# EAGLE design Mainboard v0 (EAGLE 9.6.2)
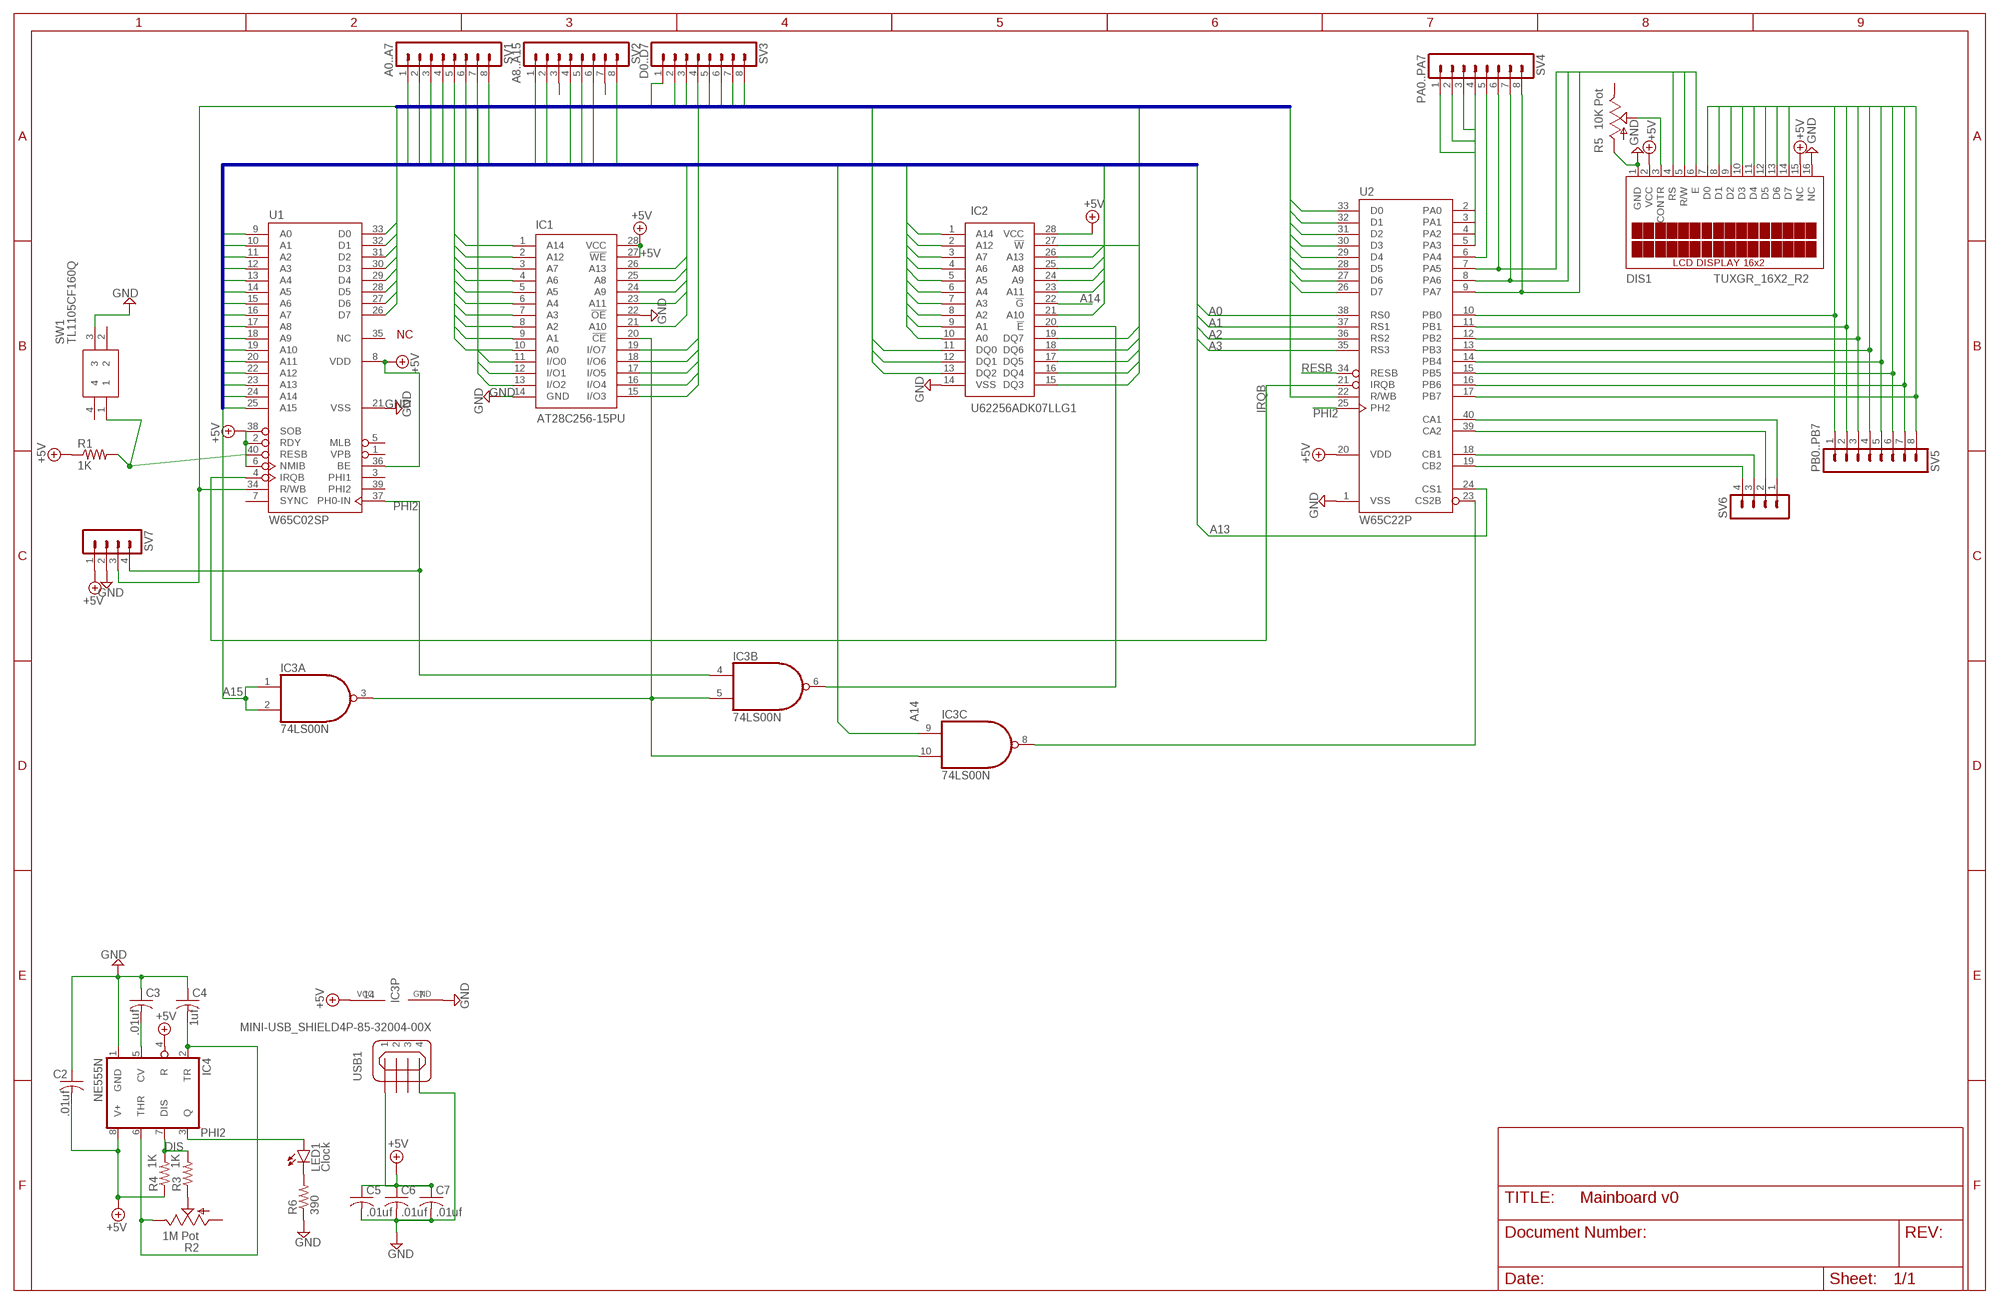
[diagram p0: schematic, sheet 1]

## Parts
C2  .01uf  C-US075-032X103  [C075-032X103]
C3  .01uf  C-US075-032X103  [C075-032X103]
C4  1uf  C-US075-032X103  [C075-032X103]
C5  .01uf  C-US075-032X103  [C075-032X103]
C6  .01uf  C-US075-032X103  [C075-032X103]
C7  .01uf  C-US075-032X103  [C075-032X103]
DIS1  TUXGR_16X2_R2  [TUXGR_16X2_R2]
IC1  AT28C256-15PU  [DIP1556W56P254L3702H483Q28N]
IC2  U62256ADK07LLG1  [DIP1524W59P254L3710H510Q28N]
IC3  74LS00N  [DIL14]
IC4  NE555N  [DIL08]
LED1  Clock  LED5MM  [LED5MM]
R1  1K  R-US_0204/7  [0204/7]
R2  1M Pot  TRIM_US-B25U  [B25U]
R3  1K  R-US_0204/7  [0204/7]
R4  1K  R-US_0204/7  [0204/7]
R5  10K Pot  TRIM_US-B25U  [B25U]
R6  390  R-US_0204/7  [0204/7]
SV1  A0..A7  MA08-1NL  [MA08-1]
SV2  A8..A15  MA08-1  [MA08-1]
SV3  D0..D7  MA08-1  [MA08-1]
SV4  PA0..PA7  MA08-1  [MA08-1]
SV5  PB0..PB7  MA08-1  [MA08-1]
SV6  MA04-1  [MA04-1]
SV7  MA04-1  [MA04-1]
SW1  TL1105CF160Q  [TL1105CF160Q]
U1  W65C02SP  [DIP-40]
U2  W65C22P  G65SC22P  [DIP-40]
USB1  MINI-USB_SHIELD4P-85-32004-00X  [85-32004-00X]

## Nets
+5V: C2.2 C5.1 C6.1 C7.1 DIS1.2(VCC) DIS1.15(NC) IC1.27(!WE) IC1.28(VCC) IC2.28(VCC) IC3.14(P:VCC) IC4.4(R) IC4.8(V+) R1.1 R4.1 SV7.1 U1.2(RDY) U1.6(NMIB) U1.8(VDD) U1.36(BE) U1.38(SOB) U2.20(VDD) USB1.1
A0: IC1.10(A0) IC2.10(A0) SV1.1 U1.9(A0) U2.38(RS0)
A1: IC1.9(A1) IC2.9(A1) SV1.2 U1.10(A1) U2.37(RS1)
A2: IC1.8(A2) IC2.8(A2) SV1.3 U1.11(A2) U2.36(RS2)
A3: IC1.7(A3) IC2.7(A3) SV1.4 U1.12(A3) U2.35(RS3)
A4: IC1.6(A4) IC2.6(A4) SV1.5 U1.13(A4)
A5: IC1.5(A5) IC2.5(A5) SV1.6 U1.14(A5)
A6: IC1.4(A6) IC2.4(A6) SV1.7 U1.15(A6)
A7: IC1.3(A7) IC2.3(A7) SV1.8 U1.16(A7)
A8: IC1.25(A8) IC2.25(A8) SV2.1 U1.17(A8)
A9: IC1.24(A9) IC2.24(A9) SV2.2 U1.18(A9)
A10: IC1.21(A10) IC2.21(A10) SV2.3 U1.19(A10)
A11: IC1.23(A11) IC2.23(A11) SV2.4 U1.20(A11)
A12: IC1.2(A12) IC2.2(A12) SV2.5 U1.22(A12)
A13: IC1.26(A13) IC2.26(A13) SV2.6 U1.23(A13) U2.24(CS1)
A14: IC1.1(A14) IC2.1(A14) IC2.22(!G) IC3.9(C:I0) SV2.7 U1.24(A14)
A15: IC3.1(A:I0) IC3.2(A:I1) SV2.8 U1.25(A15)
CLK-1: C4.2 IC4.2(TR) IC4.6(THR) R2.E
D0: IC1.11(I/O0) IC2.11(DQ0) SV3.1 U1.33(D0) U2.33(D0)
D1: IC1.12(I/O1) IC2.12(DQ1) SV3.2 U1.32(D1) U2.32(D1)
D2: IC1.13(I/O2) IC2.13(DQ2) SV3.3 U1.31(D2) U2.31(D2)
D3: IC1.15(I/O3) IC2.15(DQ3) SV3.4 U1.30(D3) U2.30(D3)
D4: IC1.16(I/O4) IC2.16(DQ4) U1.29(D4) U2.29(D4)
D5: IC1.17(I/O5) IC2.17(DQ5) SV3.5 SV3.6 U1.28(D5) U2.28(D5)
D6: IC1.18(I/O6) IC2.18(DQ6) SV3.7 U1.27(D6) U2.27(D6)
D7: IC1.19(I/O7) IC2.19(DQ7) SV3.8 U1.26(D7) U2.26(D7)
DIS: IC4.7(DIS) R3.2 R4.2
GND: C2.1 C3.1 C4.1 C5.2 C6.2 C7.2 DIS1.1(GND) DIS1.16(NC) IC1.14(GND) IC1.22(!OE) IC2.14(VSS) IC3.7(P:GND) IC4.1(GND) R5.A R6.1 SV7.2 SW1.3 U1.21(VSS) U2.1(VSS) USB1.4
IRQB: U1.4(IRQB) U2.21(IRQB)
N$1: IC1.20(!CE) IC3.3(A:O) IC3.5(B:I1) IC3.10(C:I1)
N$2: IC3.8(C:O) U2.23(CS2B)
N$3: R2.S R3.1
N$4: C3.2 IC4.5(CV)
N$5: LED1.K(C) R6.2
N$6: IC2.20(!E) IC3.6(B:O)
N$7: DIS1.3(CONTR) R5.S
N$8: DIS1.7(D0) SV5.1 U2.10(PB0)
N$9: DIS1.8(D1) SV5.2 U2.11(PB1)
N$10: DIS1.9(D2) SV5.3 U2.12(PB2)
N$11: DIS1.10(D3) SV5.4 U2.13(PB3)
N$12: DIS1.11(D4) SV5.5 U2.14(PB4)
N$13: DIS1.12(D5) SV5.6 U2.15(PB5)
N$14: DIS1.13(D6) SV5.7 U2.16(PB6)
N$15: DIS1.14(D7) SV5.8 U2.17(PB7)
N$16: DIS1.6(E) SV4.8 U2.9(PA7)
N$17: DIS1.5(R/W) SV4.7 U2.8(PA6)
N$18: DIS1.4(RS) SV4.6 U2.7(PA5)
N$19: SV4.1 U2.2(PA0)
N$20: SV4.2 U2.3(PA1)
N$21: SV4.3 U2.4(PA2)
N$22: SV4.4 U2.5(PA3)
N$23: SV4.5 U2.6(PA4)
N$24: SV6.1 U2.40(CA1)
N$25: SV6.2 U2.39(CA2)
N$26: SV6.3 U2.18(CB1)
N$27: SV6.4 U2.19(CB2)
PHI2: IC3.4(B:I0) IC4.3(Q) LED1.A SV7.4 U1.37(PH0-IN) U2.25(PH2)
RESB: R1.2 SW1.1 U1.40(RESB) U2.34(RESB)
RWB: IC2.27(!W) SV7.3 U1.34(R/WB) U2.22(R/WB)
Unconnected: IC3.11(D:O) IC3.12(D:I0) IC3.13(D:I1) R2.A R5.E SW1.2 SW1.4 U1.1(VPB) U1.3(PHI1) U1.5(MLB) U1.7(SYNC) U1.35(NC) U1.39(PHI2) USB1.2 USB1.3 USB1.M1(S1) USB1.M2(S2)

## Buses
ADDR:A0,A1,A2,A3,A4,A5,A6,A7,A8,A9,A10,A11,A12,A13,A14,A15
DATA:D0,D1,D2,D3,D4,D5,D6,D7,RWB

## Library data of the parts
C2-C7 = rcl:C-US: CAPACITOR, American symbol; SPICEPREFIX: C
DIS1 = display-lcd:TUXGR_16X2_R2: Tuxgraphics LCD display 16x2 characters reflective, without background light Source: tuxgr_12x2_r2.pdf; OC_FARNELL: unknown; OC_NEWARK: unknown
IC1 = SamacSys_Parts:AT28C256-15PU: AT28C256-15PU, Parallel EEPROM Memory 256kbit, Parallel, 150ns 4.5 5.5 V, 28-Pin PDIP Source: Datasheet <http://docs-emea.rs-online.com/webdocs/1383/0900766b81383aa7.pdf>; ARROW_PART_NUMBER: AT28C256-15PU; ARROW_PRICE-STOCK: https://www.arrow.com/en/products/at28c256-15pu/microchip-technology; DESCRIPTION: AT28C256-15PU, Parallel EEPROM Memory 256kbit, Parallel, 150ns 4.5 5.5 V, 28-Pin PDIP; HEIGHT: 4.826mm; MANUFACTURER_NAME: Microchip; MANUFACTURER_PART_NUMBER: AT28C256-15PU; MOUSER_PART_NUMBER: 556-AT28C25615PU; MOUSER_PRICE-STOCK: https://www.mouser.co.uk/ProductDetail/Microchip-Technology-Atmel/AT28C256-15PU?qs=MAR%2F2X5XOp7eAU2%2FlNw9oA%3D%3D
IC2 = SamacSys_Parts:U62256ADK07LLG1: SRAM ZMD 32K x 8 5V Asynch Source: Datasheet <https://www.alliancememory.com/wp-content/uploads/pdf/ZMD_U62256A.pdf>; DESCRIPTION: SRAM ZMD 32K x 8 5V Asynch; HEIGHT: 5.1mm; MANUFACTURER_NAME: Alliance Memory; MANUFACTURER_PART_NUMBER: U62256ADK07LLG1; MOUSER_PART_NUMBER: 913-U62256ADK07LLG1; MOUSER_PRICE-STOCK: https://www.mouser.co.uk/ProductDetail/Alliance-Memory/U62256ADK07LLG1?qs=LD2UibpCYJr50j%252B%252B4ajYoA%3D%3D
IC3 = 74xx-us:74*00: Quad 2-input NAND gate
IC4 = linear:*555: TIMER
LED1 = led:LED: LED OSRAM: - CHIPLED LG R971, LG N971, LY N971, LG Q971, LY Q971, LO R971, LY R971 LH N974, LH R974 LS Q976, LO Q976, LY Q976 LO Q996 - Hyper CHIPLED LW Q18S LB Q993, LB Q99A, LB R99A - SideLED LS A670, LO A670, LY A670, LG A670, LP A670 LB A673, LV A673, LT A673, LW A673 LH A674 LY A675 LS A676, LA A676, LO A676, LY A676, LW A676 LS A679, LY A679, LG A679 - Hyper Micro SIDELED® LS Y876, LA Y876, LO Y876, LY Y876 LT Y87S - SmartLED LW L88C, LW L88S LB L89C, LB L89S, LG L890 LS L89K, LO L89K, LY L89K LS L896, LA L896, LO L896, LY L896 - TOPLED LS T670, LO T670, LY T670, LG T670, LP T670 LSG T670, LSP T670, LSY T670, LOP T670, LYG T670 LG T671, LOG T671, LSG T671 LB T673, LV T673, LT T673, LW T673 LH T674 LS T676, LA T676, LO T676, LY T676, LB T676, LH T676, LSB T676, LW T676 LB T67C, LV T67C, LT T67C, LS T67K, LO T67K, LY T67K, LW E67C LS E67B, LA E67B, LO E67B, LY E67B, LB E67C, LV E67C, LT E67C LW T67C LS T679, LY T679, LG T679 LS T770, LO T770, LY T770, LG T770, LP T770 LB T773, LV T773, LT T773, LW T773 LH T774 LS E675, LA E675, LY E675, LS T675 LS T776, LA T776, LO T776, LY T776, LB T776 LHGB T686 LT T68C, LB T68C - Hyper Mini TOPLED® LB M676 - Mini TOPLED Santana® LG M470 LS M47K, LO M47K, LY M47K Source: http://www.osram.convergy.de LUXEON: - LUMILED® LXK2-PW12-R00, LXK2-PW12-S00, LXK2-PW14-U00, LXK2-PW14-V00 LXK2-PM12-R00, LXK2-PM12-S00, LXK2-PM14-U00 LXK2-PE12-Q00, LXK2-PE12-R00, LXK2-PE12-S00, LXK2-PE14-T00, LXK2-PE14-U00 LXK2-PB12-K00, LXK2-PB12-L00, LXK2-PB12-M00, LXK2-PB14-N00, LXK2-PB14-P00, LXK2-PB14-Q00 LXK2-PR12-L00, LXK2-PR12-M00, LXK2-PR14-Q00, LXK2-PR14-R00 LXK2-PD12-Q00, LXK2-PD12-R00, LXK2-PD12-S00 LXK2-PH12-R00, LXK2-PH12-S00 LXK2-PL12-P00, LXK2-PL12-Q00, LXK2-PL12-R00 Source: www.luxeon.com KINGBRIGHT: KA-3528ASYC Source: www.kingbright.com
R1 R3 R4 R6 = rcl:R-US_: RESISTOR, American symbol; SPICEPREFIX: R
R2 R5 = pot:TRIM_US-: POTENTIOMETER
SV1 = con-lstb:MA08-1: PIN HEADER; SPICEPREFIX: X
SV2-SV5 = con-lstb:MA08-1: PIN HEADER; OC_FARNELL: unknown; OC_NEWARK: unknown
SV6 SV7 = con-lstb:MA04-1: PIN HEADER; OC_FARNELL: unknown; OC_NEWARK: unknown
SW1 = SamacSys_Parts:TL1105CF160Q: Tactile Switches 6X6X8MM 160GF Source: Datasheet <https://componentsearchengine.com/Datasheets/1/TL1105CF160Q.pdf>; DESCRIPTION: Tactile Switches 6X6X8MM 160GF; HEIGHT: 8mm; MANUFACTURER_NAME: E-Switch; MANUFACTURER_PART_NUMBER: TL1105CF160Q; MOUSER_PART_NUMBER: 612-TL1105C; MOUSER_PRICE-STOCK: https://www.mouser.co.uk/ProductDetail/E-Switch/TL1105CF160Q?qs=YXf4ACKMM4yAAz%252BbnhourA%3D%3D
U1 = 65xxx:W65C02SP: Western Digital Version
U2 = 65xxx:G65SC22P: California Micro Devices Version
USB1 = con-cypressindustries:MINI-USB_SHIELD4P-: MINI USB 4 Pol. Source: www.cypressindustries.com; OC_FARNELL: unknown; OC_NEWARK: unknown

## Net classes
0 default: clearance 0.205 mm

## Board
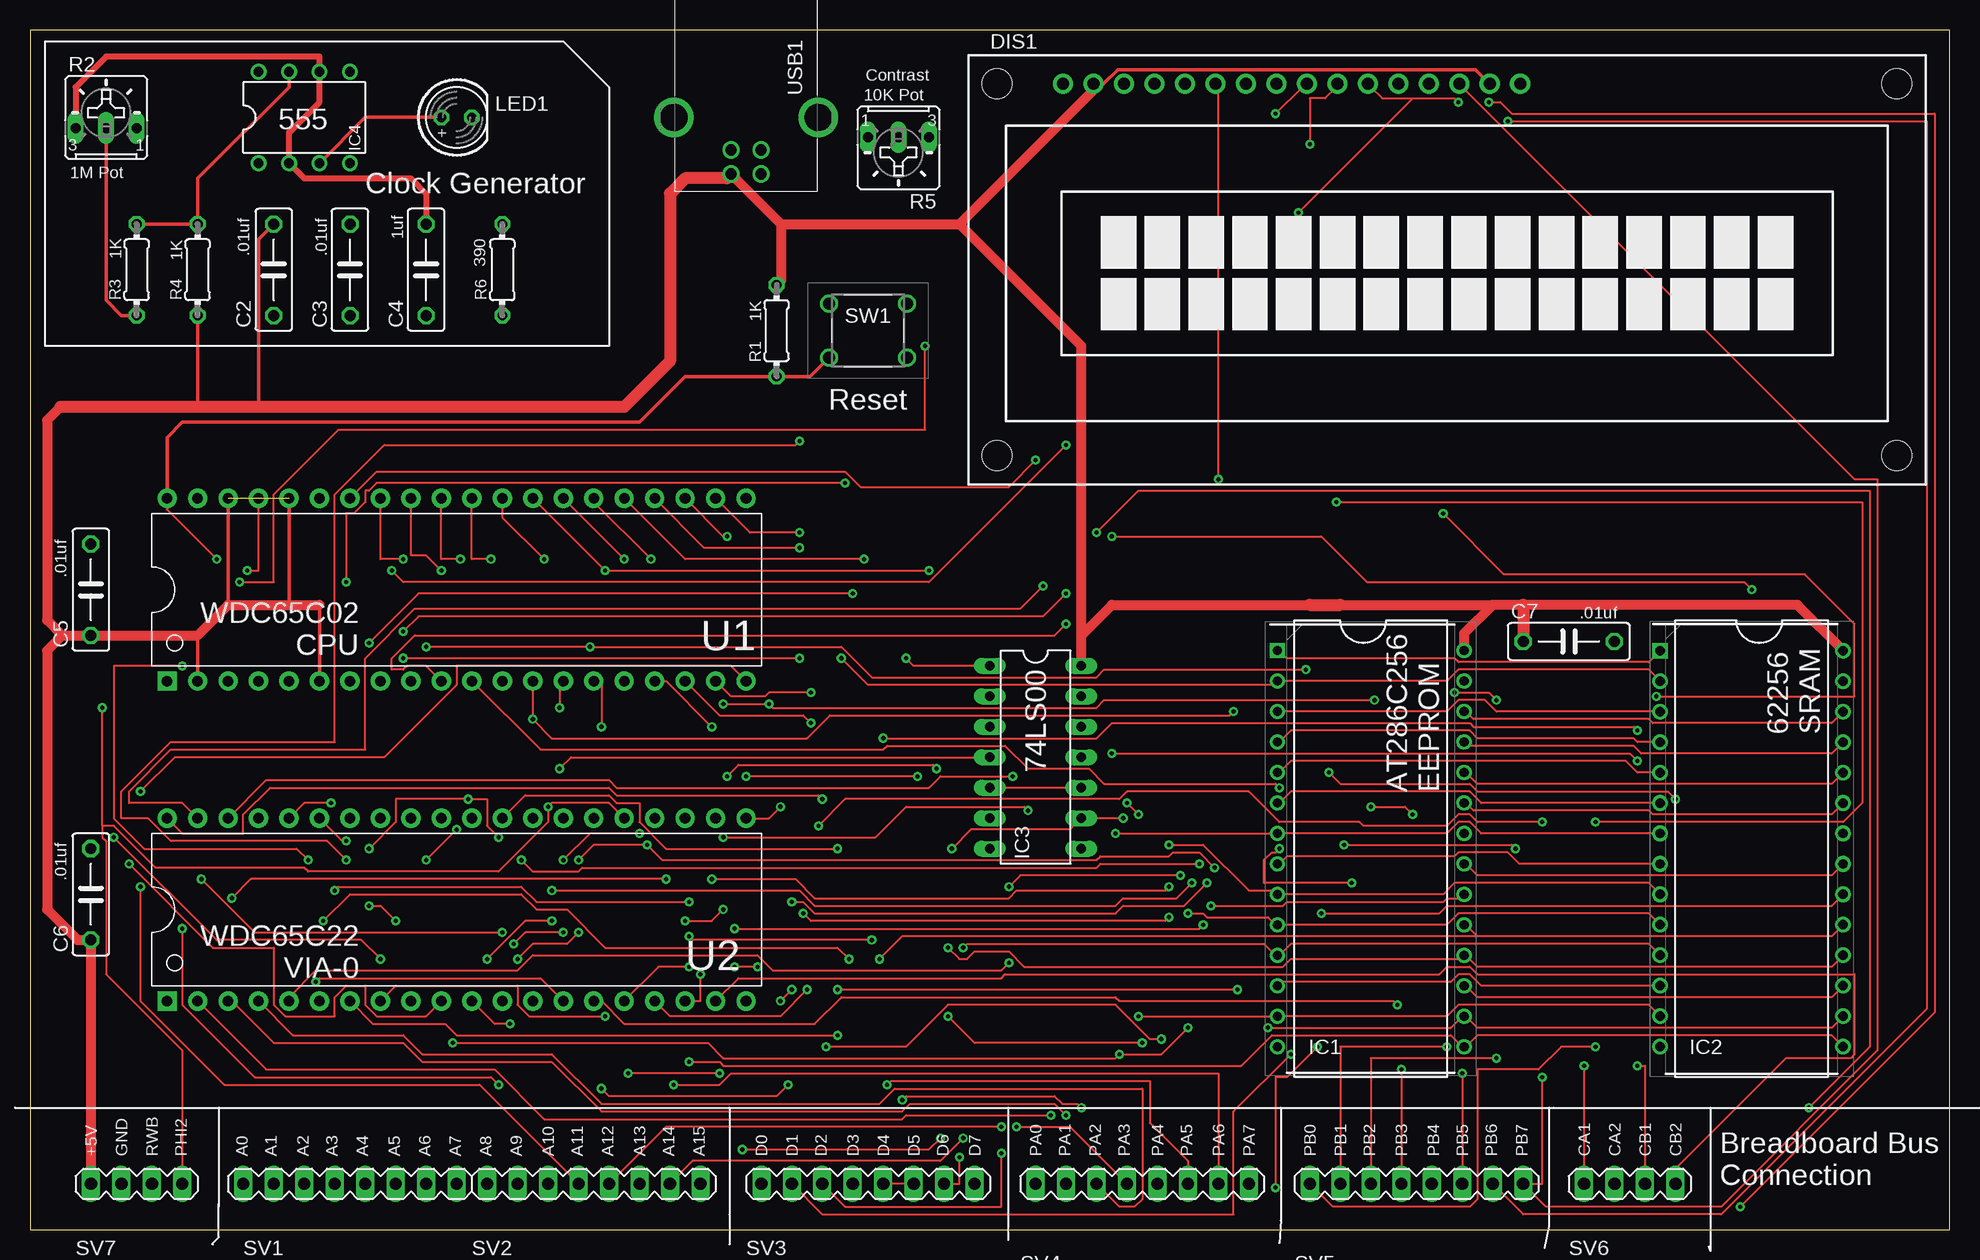
[diagram p1: board, top side]
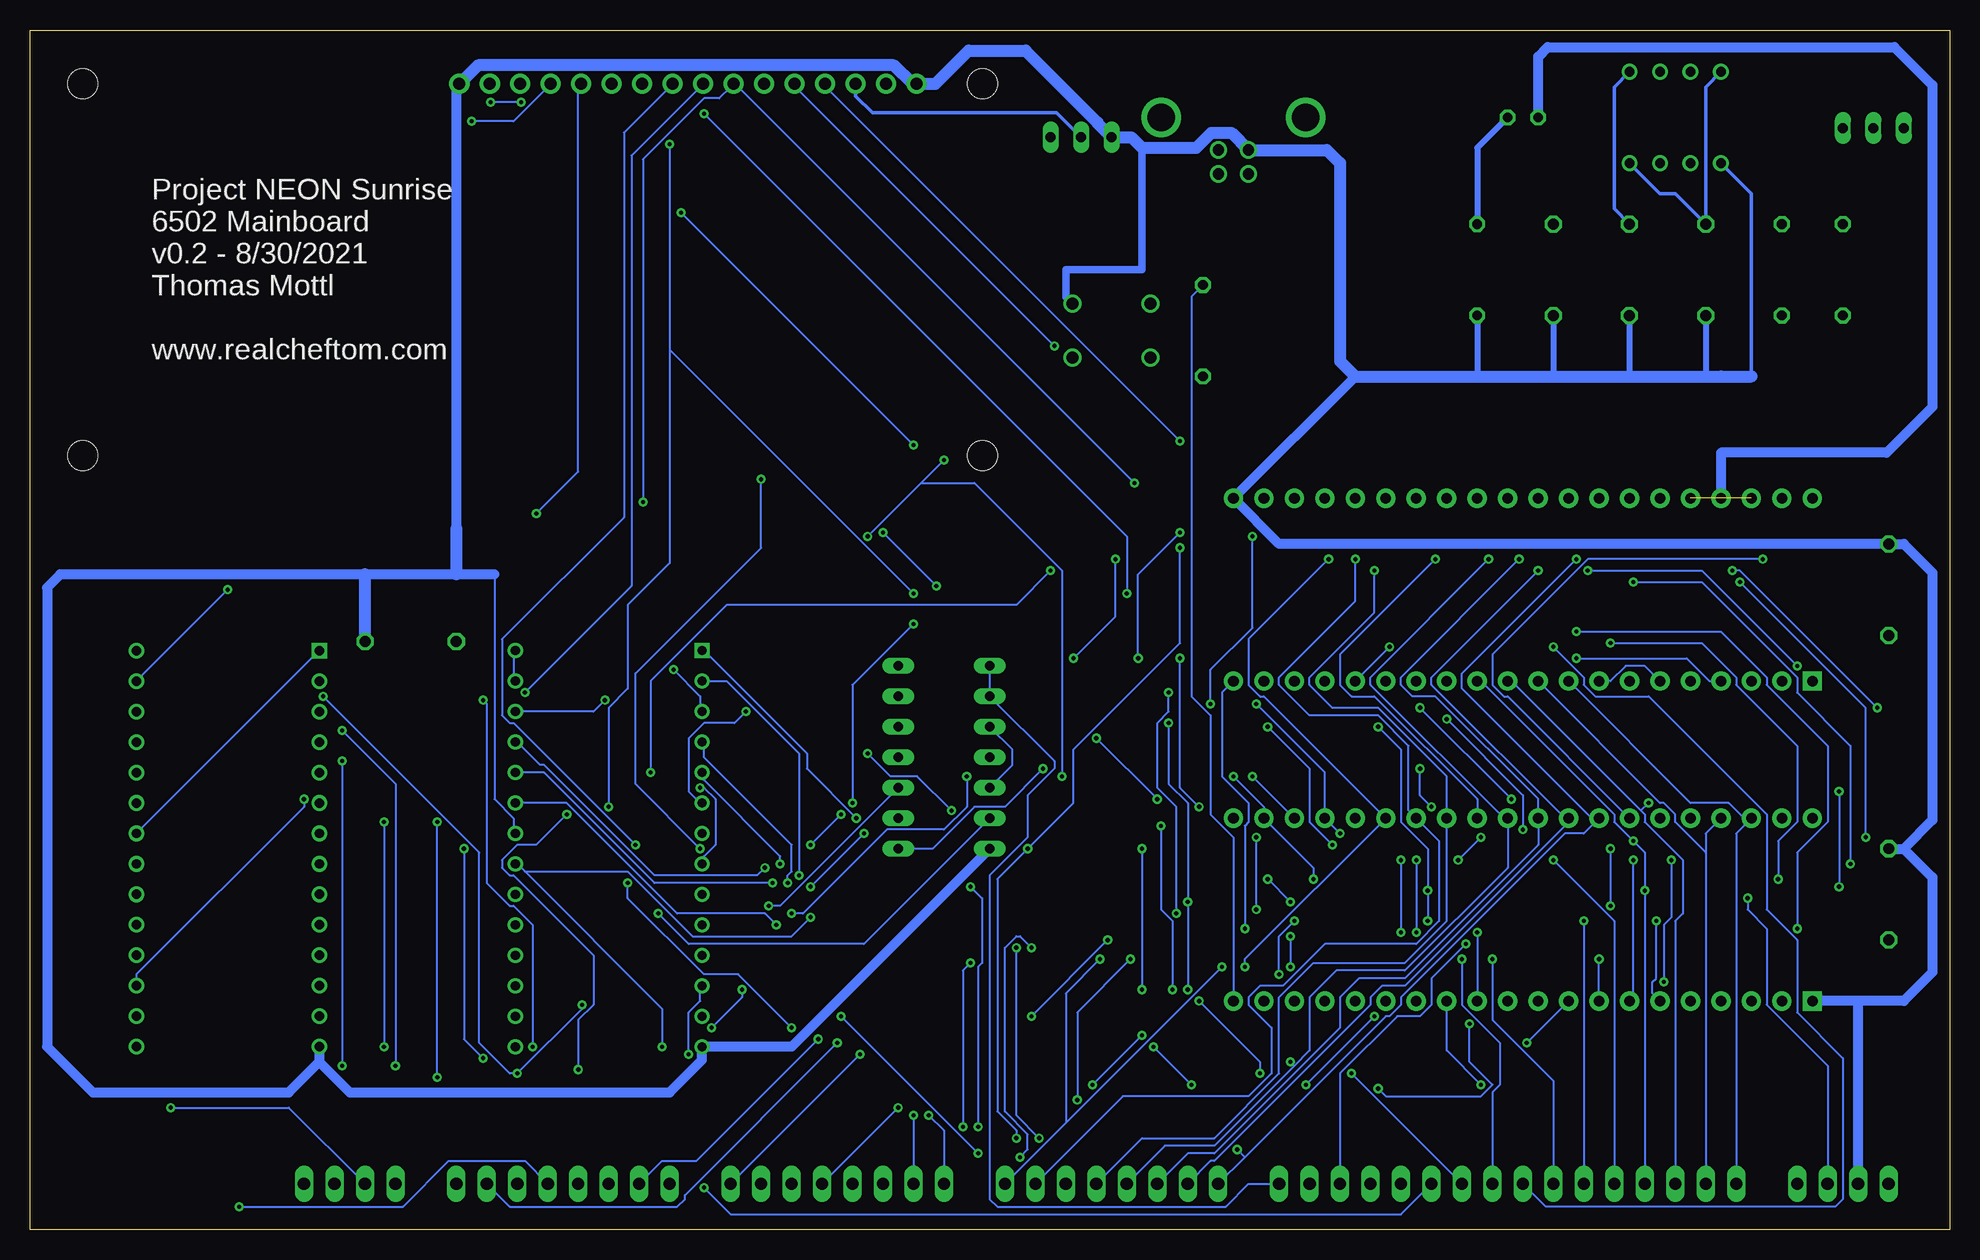
[diagram p2: board, bottom side, seen from below]

Size 160 x 100 mm. Coordinates in mm from the lower left corner, seen from the top.
Outline: 0,0 154.94,0 160,0 160,100 0,100 0,0
Copper layers (1*16): Top 0.035mm / dielectric 1.5mm / Bottom 0.035mm
Design rules "default": minimum track width 6mil, minimum drill 0.35mm, track to track 6mil, track to pad 6mil, pad to pad 6mil, via to via 6mil, smd to smd 6mil, copper to edge 40mil, drill to drill 6mil, minimum pad ring 10mil, minimum via ring 8mil, stop-mask expansion 4mil, vias tented up to drill 0mil, thermal gap 10mil

### Footprints (pad centres in the part's own frame; a part is rotated, then mirrored left to right if it is on the bottom)
C075-032X103 = drill 0.914 octagon: 1 -3.81,0; 2 3.81,0
TUXGR_16X2_R2 = drill 1 pad 1.676: 1 -32,15.5; 2 -29.46,15.5; 3 -26.92,15.5; 4 -24.38,15.5; 5 -21.84,15.5; 6 -19.3,15.5; 7 -16.76,15.5; 8 -14.22,15.5; 9 -11.68,15.5; 10 -9.14,15.5; 11 -6.6,15.5; 12 -4.06,15.5; 13 -1.52,15.5; 14 1.02,15.5; 15 3.56,15.5; 16 6.1,15.5 | hole 2.5: -37.5,-15.5; 37.5,-15.5; -37.5,15.5; 37.5,15.5
DIP1556W56P254L3702H483Q28N = drill 0.759 pad 1.159 square: 1 -7.779,16.51 | drill 0.759 pad 1.159: 2 -7.779,13.97; 3 -7.779,11.43; 4 -7.779,8.89; 5 -7.779,6.35; 6 -7.779,3.81; 7 -7.779,1.27; 8 -7.779,-1.27; 9 -7.779,-3.81; 10 -7.779,-6.35; 11 -7.779,-8.89; 12 -7.779,-11.43; 13 -7.779,-13.97; 14 -7.779,-16.51; 15 7.779,-16.51; 16 7.779,-13.97; 17 7.779,-11.43; 18 7.779,-8.89; 19 7.779,-6.35; 20 7.779,-3.81; 21 7.779,-1.27; 22 7.779,1.27; 23 7.779,3.81; 24 7.779,6.35; 25 7.779,8.89; 26 7.779,11.43; 27 7.779,13.97; 28 7.779,16.51
DIP1524W59P254L3710H510Q28N = drill 0.79 pad 1.19 square: 1 -7.62,16.51 | drill 0.79 pad 1.19: 2 -7.62,13.97; 3 -7.62,11.43; 4 -7.62,8.89; 5 -7.62,6.35; 6 -7.62,3.81; 7 -7.62,1.27; 8 -7.62,-1.27; 9 -7.62,-3.81; 10 -7.62,-6.35; 11 -7.62,-8.89; 12 -7.62,-11.43; 13 -7.62,-13.97; 14 -7.62,-16.51; 15 7.62,-16.51; 16 7.62,-13.97; 17 7.62,-11.43; 18 7.62,-8.89; 19 7.62,-6.35; 20 7.62,-3.81; 21 7.62,-1.27; 22 7.62,1.27; 23 7.62,3.81; 24 7.62,6.35; 25 7.62,8.89; 26 7.62,11.43; 27 7.62,13.97; 28 7.62,16.51
DIL14 = drill 0.813 long: 1 -7.62,-3.81; 2 -5.08,-3.81; 3 -2.54,-3.81; 4 0,-3.81; 5 2.54,-3.81; 6 5.08,-3.81; 7 7.62,-3.81; 8 7.62,3.81; 9 5.08,3.81; 10 2.54,3.81; 11 0,3.81; 12 -2.54,3.81; 13 -5.08,3.81; 14 -7.62,3.81
DIL08 = drill 0.813 pad 1.27: 1 -3.81,-3.81; 2 -1.27,-3.81; 3 1.27,-3.81; 4 3.81,-3.81; 5 3.81,3.81; 6 1.27,3.81; 7 -1.27,3.81; 8 -3.81,3.81
LED5MM = drill 0.813 octagon: A -1.27,0; K 1.27,0
0204/7 = drill 0.813 octagon: 1 -3.81,0; 2 3.81,0
B25U = drill 0.813 long: A 2.54,-0.889; E -2.54,-0.889; S 0,-0.889
MA08-1 = drill 1.016 long: 1 -8.89,0; 2 -6.35,0; 3 -3.81,0; 4 -1.27,0; 5 1.27,0; 6 3.81,0; 7 6.35,0; 8 8.89,0
MA04-1 = drill 1.016 long: 1 -3.81,0; 2 -1.27,0; 3 1.27,0; 4 3.81,0
TL1105CF160Q = drill 1 pad 1.5: 1 -3.25,-2.25; 2 3.25,-2.25; 3 3.25,2.25; 4 -3.25,2.25
DIP-40 = drill 0.889 pad 1.6 square: 1 -22.86,-7.62 | drill 0.889 pad 1.6: 2 -20.32,-7.62; 3 -17.78,-7.62; 4 -15.24,-7.62; 5 -12.7,-7.62; 6 -10.16,-7.62; 7 -7.62,-7.62; 8 -5.08,-7.62; 9 -2.54,-7.62; 10 0,-7.62; 11 2.54,-7.62; 12 5.08,-7.62; 13 7.62,-7.62; 14 10.16,-7.62; 15 12.7,-7.62; 16 15.24,-7.62; 17 17.78,-7.62; 18 20.32,-7.62; 19 22.86,-7.62; 20 25.4,-7.62; 21 25.4,7.62; 22 22.86,7.62; 23 20.32,7.62; 24 17.78,7.62; 25 15.24,7.62; 26 12.7,7.62; 27 10.16,7.62; 28 7.62,7.62; 29 5.08,7.62; 30 2.54,7.62; 31 0,7.62; 32 -2.54,7.62; 33 -5.08,7.62; 34 -7.62,7.62; 35 -10.16,7.62; 36 -12.7,7.62; 37 -15.24,7.62; 38 -17.78,7.62; 39 -20.32,7.62; 40 -22.86,7.62
85-32004-00X = drill 0.92 pad 1.27: 1 4.71,-1.25; 2 4.71,1.25; 3 2.71,1.25; 4 2.71,-1.25 | drill 2.3 pad 3: M1 0,6.02; M2 0,-6.02

### Placement (x,y rotation side)
C2  20.32,80.01 90 top
C3  26.67,80.01 90 top
C4  33.02,80.01 90 top
C5  5.08,53.34 90 top
C6  5.08,27.94 90 top
C7  128.27,49.02 0 top
DIS1  118.11,80.01 0 top
IC1  111.76,31.75 0 top
IC2  143.51,31.75 0 top
IC3  83.82,39.37 270 top
IC4  22.86,92.71 0 top
LED1  35.56,92.71 0 top
R1  62.23,74.93 270 top
R2  6.35,92.71 0 top
R3  8.89,80.01 90 top
R4  13.97,80.01 90 top
R5  72.39,90.17 180 top
R6  39.37,80.01 90 top
SV1  26.67,3.81 0 top
SV2  46.99,3.81 0 top
SV3  69.85,3.81 0 top
SV4  92.71,3.81 0 top
SV5  115.57,3.81 0 top
SV6  133.35,3.81 0 top
SV7  8.89,3.81 0 top
SW1  69.85,74.93 0 top
U1  34.29,53.34 0 top
U2  34.29,26.67 0 top
USB1  59.69,92.71 270 top

### Tracks (layer width: path | path; a pad name or v marks a point on that pad's centre or on a via)
+5V  (1 unrouted)
  Top 0.305: C2.2 19.05,82.55 19.05,68.58 | R4.1 13.97,68.58 | U1.2 13.97,49.53 | 16.51,52.07 U1.38 | 24.13,52.07 U1.6 | U1.36 21.59,52.07 | DIS1.2 89.5,95.51 90.69,96.71 120.47,96.71 DIS1.15
  Top 0.813: 2.54,68.58 1.42,67.46 1.42,50.8 2.69,49.53 | 2.69,49.53 C5.1 13.97,49.53 16.51,52.07 24.13,52.07 | 2.69,49.53 1.42,48.26 1.42,26.67 3.96,24.13 C6.1 SV7.1 | USB1.1 62.62,83.82 | 62.62,83.82 77.47,83.82 | 77.47,83.82 88.65,95 DIS1.2 | IC2.28 147.32,52.07 124.46,52.07 121.92,52.07 | 121.92,52.07 119.54,49.69 IC1.28 | 109.22,52.07 121.92,52.07 | IC3.14 87.63,49.53 | 106.68,52.07 90.17,52.07 87.63,49.53 | 87.63,49.53 87.63,73.66 77.47,83.82 | 62.62,83.82 62.62,79.13 R1.1
  Top 1.016: USB1.1 58.07,87.63 54.61,87.63 53.34,86.36 53.34,72.39 49.53,68.58 19.05,68.58 13.97,68.58 2.54,68.58 | 106.68,52.07 109.22,52.07 | 124.46,52.07 C7.1
  Bottom 0.152: IC1.27 119.7,45.72 119.7,48.26 IC1.28 | U2.20 59.69,32.7 61.59,34.61 61.59,42.86 63.18,44.45 63.18,77.79 R1.1 | U1.8 28.26,45.72 26.99,46.99 25.4,46.99 U1.6
  Bottom 0.305: IC4.4 24.13,86.36 22.86,86.36 C2.2 20.32,95.25 IC4.8
A0  (via drill 0.35)
  Top 0.152: IC2.10 134.94,26.35 119.06,26.35 118.11,25.4 104.14,25.4 IC1.10 103.82,25.4 103.19,26.04 98.11,26.04 97.79,26.35 v96.52,26.35 | v81.92,37.78 75.88,37.78 74.93,36.83 48.9,36.83 48.26,37.47 19.68,37.47 U2.38
  Bottom 0.152: SV1.1 17.78,33.02 16.83,33.97 | 16.83,33.97 U2.38 16.83,33.97 | U1.9 21.59,35.56 18.41,35.56 16.83,33.97 | v96.52,26.35 95.57,26.35 88.58,33.34 83.82,33.34 81.92,35.24 v81.92,37.78
A1  (via drill 0.35)
  Top 0.152: IC2.9 134.94,28.89 118.75,28.89 117.79,27.94 104.14,27.94 IC1.9 103.82,27.94 103.5,28.26 101.6,28.26 97.79,32.07 v94.93,32.07 | v91.44,35.56 v92.39,34.61 | v86.36,50.48 85.41,49.53 32.07,49.53 30.16,47.62 30.16,46.67 31.11,46.67 31.43,46.99 33.02,46.99 U1.10
  Bottom 0.152: 20.32,31.43 20.32,33.02 U2.37 | 20.32,31.43 SV1.2 | U1.10 24.13,35.56 23.81,35.56 22.86,34.61 22.86,33.97 20.32,31.43 | v92.39,34.61 v94.93,32.07 | v91.44,35.56 91.44,45.4 v86.36,50.48
A2  (via drill 0.35)
  Top 0.152: IC2.8 124.14,30.48 123.19,31.43 119.06,31.43 118.75,31.11 104.78,31.11 104.14,30.48 IC1.8 | U2.36 22.86,35.56 v25.08,35.56 | v104.14,36.83 103.82,37.15 89.53,37.15 88.27,38.42 83.19,38.42 81.28,40.32 71.44,40.32 71.12,40.01 42.55,40.01 U1.11
  Bottom 0.152: SV1.3 22.86,25.72 22.23,26.35 22.23,30.8 25.4,33.97 25.4,34.61 25.72,34.92 | 25.72,34.92 36.51,45.72 U1.11 | 25.72,34.92 v25.08,35.56 | v104.14,36.83 103.82,36.83 102.87,35.88 102.87,32.07 103.82,31.11 103.82,30.48 IC1.8
A3  (via drill 0.35)
  Top 0.152: IC2.7 120.97,33.02 120.02,33.97 119.06,33.97 118.11,33.02 104.14,33.02 IC1.7 103.82,33.02 v90.49,33.02 | U2.35 26.04,32.38 v26.35,32.38 | v94.93,28.57 94.61,28.26 82.23,28.26 81.6,27.62 65.41,27.62 63.82,29.21 v56.83,29.21 | v54.93,27.3 42.23,27.3 40.96,28.57 25.72,28.57 v25.4,28.26
  Bottom 0.152: SV1.4 v25.4,28.26 25.4,31.43 v26.35,32.38 27.94,33.97 27.94,34.61 39.05,45.72 U1.12 | v94.93,28.57 v90.49,33.02 | v54.93,27.3 v56.83,29.21
A4  (via drill 0.35)
  Top 0.152: IC2.6 120.97,35.56 120.02,36.51 105.09,36.51 104.14,35.56 IC1.6 | v35.56,33.34 v33.02,30.8 | U1.13 v41.91,42.55 43.5,40.96 64.77,40.96 66.67,42.86 100.01,42.86 v100.33,43.18
  Bottom 0.152: SV1.5 27.94,25.72 v33.02,30.8 | v35.56,33.34 35.56,36.2 v41.91,42.55 | v100.33,43.18 101.28,42.23 103.82,42.23 105.09,40.96 105.09,36.51 104.14,35.56 IC1.6
A5  (via drill 0.35)
  Top 0.152: IC2.5 133.99,38.1 133.03,39.05 105.09,39.05 104.14,38.1 IC1.5 | v30.48,25.72 29.21,26.99 v28.26,26.99 | v28.26,31.75 30.48,33.97 30.48,35.88 v36.51,35.88 38.1,35.88 38.1,33.66 v39.05,32.7 | v44.13,43.5 44.13,45.72 U1.14 | v97.47,30.48 89.22,30.48 88.9,30.16 46.04,30.16 45.72,29.84 41.91,29.84 v40.96,30.8
  Bottom 0.152: v30.48,25.72 SV1.6 | v28.26,31.75 v28.26,26.99 | v44.13,43.5 v36.51,35.88 | v97.47,30.48 97.47,31.11 103.82,37.47 103.82,38.1 IC1.5 | v39.05,32.7 v40.96,30.8
A6  (via drill 0.35)
  Top 0.152: IC2.4 133.99,40.64 133.67,40.96 120.65,40.96 120.02,41.59 105.09,41.59 104.14,40.64 IC1.4 | v38.1,22.54 41.27,25.72 v43.5,25.72 | v47.62,41.91 47.62,45.72 U1.15 | v96.84,28.89 95.57,27.62 91.12,27.62 90.49,26.99 65.41,26.99 64.14,28.26 v43.5,28.26
  Bottom 0.152: SV1.7 33.02,12.38 38.1,17.46 v38.1,22.54 | v43.5,25.72 v43.5,28.26 43.5,31.75 45.72,33.97 45.72,40.01 v47.62,41.91 | v96.84,28.89 96.84,29.53 96.52,29.84 96.52,32.07 103.82,39.37 103.82,40.64 IC1.4
A7  (via drill 0.35)
  Top 0.152: IC2.3 122.24,43.18 121.28,44.13 119.06,44.13 118.11,43.18 104.14,43.18 IC1.3 | v33.02,48.58 v46.67,48.58 67.63,48.58 70.17,46.04 88.9,46.04 89.53,46.67 v106.36,46.67
  Bottom 0.152: SV1.8 33.66,1.91 9.53,1.91 8.89,2.54 8.89,14.29 12.7,18.1 12.7,24.13 15.24,26.67 15.24,34.61 25.08,44.45 29.53,44.45 30.48,45.4 30.48,46.04 v33.02,48.58 | U1.16 v46.67,48.58 | v106.36,46.67 104.14,44.45 104.14,43.18 IC1.3
A8  (via drill 0.35)
  Top 0.152: IC2.25 150.18,39.69 134.3,39.69 133.67,40.32 120.02,40.32 119.7,40.64 IC1.25 | v40.64,22.54 41.91,23.81 44.77,23.81 v45.72,24.77 | v45.72,30.8 46.99,32.07 v51.44,32.07 52.7,30.8 88.9,30.8 89.22,31.11 94.93,31.11 95.25,31.43 97.47,31.43 v98.74,30.16 | v56.83,41.91 53.02,45.72 U1.17
  Bottom 0.152: SV2.1 38.1,11.43 37.47,12.06 37.47,15.56 40.64,18.73 v40.64,22.54 | v45.72,30.8 v45.72,24.77 | v51.44,32.07 53.34,33.97 53.34,38.42 v56.83,41.91 | v98.74,30.16 99.38,29.53 107.95,29.53 117.16,38.73 117.47,38.73 119.38,40.64 IC1.25
A9  (via drill 0.35)
  Top 0.152: IC2.24 150.18,37.15 120.65,37.15 119.7,38.1 IC1.24 | v57.47,13.02 v49.85,13.02 | v63.5,20 v62.55,19.05 | v65.09,42.23 64.45,42.86 57.47,42.86 U1.18 | v98.11,28.89 96.2,26.99 91.12,26.99 90.49,26.35 65.41,26.35 64.45,27.3 v63.5,27.3
  Bottom 0.152: v49.85,13.02 SV2.2 | v57.47,13.02 57.47,13.97 v62.55,19.05 | v63.5,20 v63.5,27.3 63.5,35.56 65.09,37.15 v65.09,42.23 | v98.11,28.89 107.95,28.89 117.16,38.1 119.38,38.1 IC1.24
A10  (via drill 0.35)
  Top 0.152: IC2.21 150.18,29.53 120.65,29.53 119.7,30.48 IC1.21 | v103.82,3.49 103.82,12.7 104.78,12.7 v107.31,15.24 | U1.19 58.42,44.45 61.28,44.45 61.59,44.77 v65.09,44.77 | v64.45,26.35 65.09,25.72 94.61,25.72 v94.93,26.04
  Bottom 0.152: SV2.3 45.72,1.27 101.6,1.27 v103.82,3.49 | v107.31,15.24 107.31,18.41 118.75,29.84 | 118.75,29.84 119.38,30.48 IC1.21 | v65.09,44.77 65.09,43.18 66.04,42.23 66.04,36.83 64.45,35.24 v64.45,26.35 | v94.93,26.04 96.52,24.45 104.78,24.45 110.17,29.84 118.75,29.84
A11  (via drill 0.35)
  Top 0.152: IC2.23 150.18,34.61 135.25,34.61 134.94,34.92 120.33,34.92 119.7,35.56 IC1.23 | SV2.4 37.47,12.06 16.19,12.06 9.21,19.05 v9.21,28.57 | v9.21,36.51 12.06,39.37 29.53,39.37 35.56,45.4 35.56,46.99 58.42,46.99 U1.20 | v97.79,25.4 97.47,25.08 v58.74,25.08
  Bottom 0.152: v9.21,36.51 v9.21,28.57 | v97.79,25.4 98.74,26.35 106.05,26.35 115.25,35.56 119.38,35.56 IC1.23 | v58.74,25.08 58.74,33.66 58.42,33.97 58.42,35.56 60.64,37.78 60.64,44.77 U1.20
A12  (via drill 0.35)
  Top 0.152: IC2.2 134.94,46.67 119.06,46.67 118.11,45.72 104.14,45.72 IC1.2 103.82,45.72 103.5,45.4 69.85,45.4 v67.63,47.62 | SV2.5 53.02,8.57 v80.96,8.57 | v81.6,28.57 82.55,29.53 v95.89,29.53 | U1.22 60.01,58.1 v64.14,58.1
  Bottom 0.152: v80.96,8.57 80.96,21.91 80.64,22.23 80.64,27.62 v81.6,28.57 | v95.89,29.53 95.89,39.69 101.92,45.72 103.82,45.72 IC1.2 | v64.14,58.1 67.63,54.61 v67.63,47.62
A13  (via drill 0.35)
  Top 0.152: IC2.26 150.18,42.23 135.25,42.23 134.94,42.55 120.33,42.55 119.7,43.18 IC1.26 | v40.32,23.81 41.27,24.77 v44.45,24.77 | v44.45,30.8 46.67,33.02 v50.8,33.02 | U1.23 57.78,57.78 v58.1,57.78 | v57.78,43.81 v61.59,43.81 61.91,43.5 88.9,43.5 89.53,44.13 v112.08,44.13
  Bottom 0.152: SV2.6 50.8,13.02 46.04,17.78 44.13,17.78 43.18,18.73 43.18,20.95 v40.32,23.81 | v44.45,30.8 v44.45,24.77 | v50.8,33.02 U2.24 52.07,38.1 v57.78,43.81 | v58.1,57.78 58.1,50.16 61.59,46.67 v61.59,43.81 | v112.08,44.13 113.03,43.18 119.38,43.18 IC1.26
A14  (via drill 0.35)
  Top 0.152: IC2.1 134.94,47.31 119.06,47.31 118.75,47.62 104.78,47.62 104.14,48.26 IC1.1 | v91.12,34.29 IC3.9 86.68,33.34 78.42,33.34 v76.83,31.75 | SV2.7 55.24,5.71 75.88,5.71 v77.79,7.62 | U1.24 56.2,56.83 v64.14,56.83
  Bottom 0.152: IC2.1 IC2.22 | v91.12,34.29 95.25,38.42 95.25,39.69 103.82,48.26 IC1.1 | v77.79,7.62 77.79,8.26 79.38,9.84 79.38,29.21 v76.83,31.75 73.03,35.56 73.03,40.01 64.14,48.9 v64.14,56.83
A15  (via drill 0.35)
  Top 0.152: U1.25 54.61,55.88 v69.53,55.88 | v73.03,47.62 73.66,46.99 IC3.1
  Bottom 0.152: IC3.1 IC3.2 74.61,39.05 74.61,38.42 76.83,36.2 76.83,32.7 80.01,29.53 80.01,2.54 79.38,1.91 60.33,1.91 58.42,3.81 SV2.8 | v69.53,55.88 69.53,51.12 v73.03,47.62
CLK-1
  Top 0.508: R2.E 3.81,95.25 6.35,97.79 24.13,97.79 IC4.6 24.13,93.98 21.59,91.44 IC4.2 22.86,87.63 31.75,87.63 33.02,86.36 C4.2
D0  (via drill 0.35)
  Top 0.152: IC2.11 134.94,23.81 105.09,23.81 104.14,22.86 IC1.11 103.82,22.86 102.87,23.81 78.11,23.81 v77.79,23.5 | U1.33 29.21,55.88 v31.11,55.88 | v75.88,7.62 74.93,6.67 v59.37,6.67
  Bottom 0.152: 58.74,6.03 46.99,17.78 46.67,17.78 45.72,18.73 45.72,19.37 32.07,33.02 30.48,33.02 29.53,33.97 | 58.74,6.03 SV3.1 | 29.53,33.97 U2.33 29.53,33.97 | v31.11,55.88 40.64,46.35 40.64,45.09 29.53,33.97 | v77.79,23.5 77.79,9.53 v75.88,7.62 | 58.74,6.03 v59.37,6.67
D1  (via drill 0.35)
  Top 0.152: IC2.12 120.97,20.32 120.02,21.27 119.06,21.27 118.43,20.64 104.46,20.64 104.14,20.32 IC1.12 | U1.32 31.75,56.2 33.02,56.2 v34.29,54.93 | v105.09,14.61 100.33,9.84 100.33,1.27 66.04,1.27 SV3.2
  Bottom 0.152: SV3.2 61.59,5.71 61.28,5.71 48.26,18.73 48.26,19.37 47.31,20.32 45.4,20.32 31.75,33.97 | 31.75,33.97 U2.32 31.75,33.97 | v34.29,54.93 43.18,46.04 43.18,45.4 31.75,33.97 | v105.09,14.61 105.09,18.1 104.14,19.05 104.14,20.32 IC1.12
D2  (via drill 0.35)
  Top 0.152: IC2.13 134.94,18.73 119.06,18.73 118.11,17.78 104.14,17.78 IC1.13 103.82,17.78 v92.39,17.78 | U1.31 34.29,55.88 v35.88,55.88 | v80.96,6.35 80.96,1.91 67.94,1.91 SV3.3
  Bottom 0.152: SV3.3 63.5,6.35 61.28,6.35 50.8,16.83 50.8,19.37 49.21,20.95 45.4,20.95 34.29,32.07 U2.31 34.29,35.88 42.86,44.45 44.77,44.45 45.72,45.4 45.72,46.04 v35.88,55.88 | v80.96,6.35 v92.39,17.78
D3  (via drill 0.35)
  Top 0.152: IC2.15 150.18,16.19 120.65,16.19 119.7,15.24 IC1.15 119.38,15.24 118.43,16.19 103.5,16.19 100.97,13.65 57.78,13.65 57.47,13.97 v54.93,13.97 | U1.30 36.83,55.88 v38.42,55.88
  Bottom 0.152: SV3.4 65.41,6.99 61.28,6.99 54.61,13.65 | 54.61,13.65 53.34,14.92 53.34,19.37 51.12,21.59 45.4,21.59 36.83,30.16 36.83,33.97 | 36.83,33.97 U2.30 36.83,33.97 | v38.42,55.88 48.26,46.04 48.26,45.4 36.83,33.97 | 54.61,13.65 v54.93,13.97
D4  (via drill 0.35)
  Top 0.152: IC2.16 150.18,16.83 120.65,16.83 119.7,17.78 IC1.16 119.38,17.78 118.43,16.83 v103.19,16.83 | v42.86,55.88 39.37,59.37 U1.29 | v67.31,20 v100.65,20 | v67.31,31.75 53.02,31.75 50.8,33.97 50.8,35.56 48.9,35.56 48.26,36.2 41.27,36.2 U2.29
  Bottom 0.152: U2.29 39.37,35.88 47.94,44.45 49.85,44.45 50.8,45.4 50.8,47.94 v42.86,55.88 | v103.19,16.83 100.65,19.37 v100.65,20 | v67.31,31.75 v67.31,20
D5  (via drill 0.35)
  Top 0.152: IC2.17 150.18,19.37 120.65,19.37 119.7,20.32 IC1.17 | SV3.6 SV3.5 | U1.28 v47.94,54.93 v74.93,54.93 | v137.16,35.88 136.53,36.51 120.65,36.51 120.02,37.15 109.22,37.15 v108.27,38.1
  Bottom 0.152: SV3.5 67.31,7.62 61.28,7.62 55.88,13.02 55.88,19.37 53.02,22.23 45.4,22.23 41.91,25.72 U2.28 41.91,37.78 47.62,43.5 51.44,43.5 53.34,45.4 53.34,46.04 47.94,51.44 v47.94,54.93 | IC2.17 151.13,21.27 137.16,35.24 v137.16,35.88 | v108.27,38.1 108.27,45.72 101.92,52.07 77.79,52.07 v74.93,54.93
D6  (via drill 0.35)
  Top 0.152: IC2.18 150.18,21.91 120.65,21.91 119.7,22.86 IC1.18 119.38,22.86 119.06,22.54 105.09,22.54 104.46,21.91 82.87,21.91 81.6,23.18 78.74,23.18 78.11,22.54 77.47,22.54 v76.52,23.5 | v49.53,55.88 U1.27 | v77.47,6.03 77.47,3.81 SV3.7
  Bottom 0.152: SV3.7 68.9,11.11 58.42,11.11 56.52,13.02 56.52,16.83 58.42,18.73 58.42,19.37 57.47,20.32 55.56,20.32 52.07,23.81 44.45,23.81 42.55,25.72 42.55,32.38 U2.27 45.09,34.92 45.09,40.32 47.62,42.86 53.34,42.86 55.88,45.4 55.88,46.04 49.53,52.39 v49.53,55.88 | v76.52,23.5 77.47,24.45 77.79,24.45 78.74,23.5 78.74,9.84 76.83,7.94 76.83,6.67 v77.47,6.03
D7  (via drill 0.35)
  Top 0.152: v51.75,55.88 46.99,60.64 U1.26 | 120.65,24.45 119.7,25.4 IC1.19 | 120.65,24.45 150.18,24.45 IC2.19 | v70.8,22.54 72.71,24.45 120.65,24.45 | v60.64,21.91 v58.74,21.91
  Bottom 0.152: v51.75,55.88 58.42,49.21 58.42,45.4 57.47,44.45 57.15,44.45 U2.26 58.74,22.54 v58.74,21.91 | 73.66,8.89 SV3.8 | 73.66,8.89 73.66,19.68 v70.8,22.54 | 73.66,8.89 v60.64,21.91
DIS
  Top 0.305: R3.2 R4.2 13.97,87.63 21.59,95.25 IC4.7
GND
  Bottom 0.152: IC1.22 119.7,33.02 119.7,34.29 121.28,35.88 121.28,54.29 121.28,54.61
  Bottom 0.305: IC4.1 16.51,86.36 16.51,71.12 | 124.46,95.25 124.46,95.26 DIS1.16
  Bottom 0.508: R6.1 39.37,71.12 | C4.1 33.02,71.12 | C3.1 26.67,71.12 | C2.1 20.32,71.12
  Bottom 0.61: 67.31,90.17 67.31,80.01 73.66,80.01 73.66,77.74 SW1.3
  Bottom 0.813: 49.53,71.12 U1.21 55.88,57.15 C5.2 3.81,57.15 1.42,54.76 1.42,34.14 3.81,31.75 | C6.2 3.81,31.75 | 3.81,31.75 1.42,29.36 1.42,21.44 3.81,19.05 7.62,19.05 | 7.62,19.05 U2.1 | SV7.2 7.62,19.05 | IC2.14 135.89,13.97 | 135.89,13.97 133.35,11.43 106.68,11.43 103.98,14.13 IC1.14 96.52,15.24 IC3.7 | 124.46,95.25 124.46,58.42 | 121.28,54.61 124.46,54.61 132.08,54.61 135.89,54.61 157.48,54.61 158.58,53.51 158.58,15.24 154.77,11.43 138.43,11.43 135.89,13.97
  Bottom 1.016: 16.51,71.12 19.05,71.12 20.32,71.12 26.67,71.12 33.02,71.12 39.37,71.12 49.53,71.12 50.8,72.39 50.8,88.9 51.9,90 USB1.4 59.87,91.43 61.53,91.43 62.79,90.17 67.31,90.17 68.2,91.06 R5.A 71.02,92.23 71.02,92.29 77.01,98.28 81.76,98.28 84.53,95.51 DIS1.1 86.46,95.51 88.01,97.06 122.65,97.06 124.46,95.25 | 124.46,58.42 124.46,54.61 | C7.2 132.08,54.61
IRQB  (via drill 0.35)
  Top 0.152: v64.14,47.62 v31.11,47.62 | v62.55,35.24 61.59,34.29 U2.21
  Bottom 0.152: U1.4 20,45.72 21.91,47.62 v31.11,47.62 | v64.14,47.62 64.14,36.83 v62.55,35.24
N$1  (via drill 0.35)
  Top 0.152: v98.42,26.99 104.46,26.99 104.78,27.3 117.79,27.3 118.11,27.62 119.06,27.62 119.38,27.94 IC1.20 | IC3.10 IC3.5
  Bottom 0.152: v98.42,26.99 97.47,26.99 IC3.10 | IC3.3 78.11,40.01 78.11,38.73 IC3.5
N$2  (via drill 0.35)
  Top 0.152: v75.56,38.42 75.25,38.73 59.05,38.73 v58.1,37.78
  Bottom 0.152: IC3.8 84.77,31.75 81.28,35.24 78.74,35.24 v75.56,38.42 | U2.23 v58.1,37.78
N$3
  Top 0.305: R2.S 6.35,77.47 7.62,76.2 R3.1
N$4
  Bottom 0.305: IC4.5 27.94,95.25 27.94,85.09 C3.2
N$5
  Bottom 0.508: LED1.K 39.37,90.17 R6.2
N$6  (via drill 0.35)
  Top 0.152: IC2.20 150.18,26.99 118.11,26.99 117.47,26.35 v107.63,26.35
  Bottom 0.152: v107.63,26.35 105.09,23.81 90.49,23.81 IC3.6
N$7
  Bottom 0.305: DIS1.3 91.19,94.49 | 91.19,94.49 | 91.19,94.49 89.79,93.09 74.42,93.09 R5.S
N$8  (via drill 0.35)
  Top 0.152: SV5.1 108.58,1.91 120.02,1.91 120.65,2.54 120.65,13.34 125.73,13.34 127.64,15.24 v130.49,15.24 | v130.49,33.97 151.13,33.97 152.72,35.56 152.72,60.64 v108.9,60.64 | U2.10 33.02,17.78 28.89,17.78 27.94,18.73 27.94,20.32 26.35,20.32 25.4,19.37 25.4,17.78 21.27,17.78 20.32,18.73 20.32,23.5 15.24,23.5 v8.26,30.48 | v26.35,53.98 26.35,59.69 26.99,59.69 27.94,60.64 27.94,61.59 28.26,61.59 28.89,62.23 v67.94,62.23
  Bottom 0.152: v130.49,33.97 v130.49,15.24 | v108.9,60.64 108.9,89.22 103.82,94.3 102.55,94.3 101.6,95.25 DIS1.7 101.28,95.57 v67.94,62.23 | v8.26,30.48 8.26,40.32 12.7,44.77 12.7,46.04 20.64,53.98 v26.35,53.98
N$9  (via drill 0.35)
  Top 0.152: SV5.2 109.22,15.24 v118.11,15.24 | v122.24,44.13 121.6,44.77 v118.75,44.77 | U2.11 38.73,17.14 v40.01,17.14 | v47.62,11.75 48.26,11.11 62.23,11.11 v63.18,12.06 | v66.36,15.24 73.03,15.24 76.52,18.73 90.49,18.73 93.34,15.88 v94.3,15.88
  Bottom 0.152: v118.11,15.24 118.11,25.4 119.7,26.99 120.02,26.99 121.92,28.89 121.92,43.81 v122.24,44.13 | v118.75,44.77 109.86,53.66 109.86,89.53 104.14,95.25 DIS1.8 | v40.01,17.14 40.01,13.97 38.1,12.06 39.05,11.11 46.99,11.11 v47.62,11.75 | v66.36,15.24 v63.18,12.06 | v94.3,15.88 104.46,5.71 107.31,5.71 SV5.2
N$10  (via drill 0.35)
  Top 0.152: SV5.3 111.76,14.29 v122.24,14.29 | v123.83,31.75 123.51,32.07 v109.54,32.07 | v39.37,24.77 18.73,24.77 v14.29,29.21 | v28.26,48.9 32.38,53.02 v68.58,53.02 | v103.82,93.03 106.05,95.25 106.36,95.25 DIS1.9
  Bottom 0.152: v122.24,14.29 123.83,15.88 v123.83,31.75 | v109.54,32.07 119.7,42.23 120.02,42.23 120.65,42.86 120.65,49.21 110.49,59.37 110.49,91.44 106.68,95.25 DIS1.9 | v39.37,24.77 U2.12 | v14.29,29.21 14.29,32.38 12.7,33.97 12.7,40.32 17.78,45.4 17.78,46.04 20.64,48.9 v28.26,48.9 | v68.58,53.02 68.58,57.78 v103.82,93.03
N$11  (via drill 0.35)
  Top 0.152: v114.3,13.34 SV5.4 | v115.25,34.61 114.62,35.24 v111.76,35.24 | v106.68,90.49 106.68,94.3 107.95,94.3 108.9,95.25 DIS1.10 | v39.05,12.06 38.42,12.7 18.73,12.7 12.7,18.73 v12.7,25.08 | v31.11,49.85 32.38,51.12 84.45,51.12 v86.36,53.02
  Bottom 0.152: v114.3,13.34 114.3,17.46 113.03,18.73 113.03,22.86 119.7,29.53 120.02,29.53 120.65,30.16 120.65,30.8 119.38,32.07 117.79,32.07 v115.25,34.61 | v111.76,35.24 111.76,43.5 110.17,45.09 110.17,52.07 106.68,55.56 106.68,73.34 | v106.68,90.49 106.68,73.34 | U2.13 41.91,14.92 v39.05,12.06 | v12.7,25.08 12.7,31.43 10.16,33.97 10.16,40.32 15.24,45.4 15.24,46.04 19.05,49.85 v31.11,49.85 | 106.68,73.34 v86.36,53.02
N$12  (via drill 0.35)
  Top 0.152: v142.56,1.91 158.75,18.1 158.75,93.03 123.51,93.03 122.56,93.98 v121.6,93.98 | v119.06,93.98 118.75,94.3 115.25,94.3 | 115.25,94.3 112.71,94.3 111.76,95.25 DIS1.11 | U2.14 42.55,20.95 24.13,20.95 v23.81,20.64 | v23.18,30.8 22.23,31.75 9.53,31.75 6.99,34.29 6.99,46.99 v12.7,46.99 | v30.16,54.93 31.11,53.98 74.93,53.98 v86.36,65.41 | 115.25,94.3 v105.73,84.77
  Bottom 0.152: SV5.5 118.75,5.71 125.09,5.71 128.91,1.91 v142.56,1.91 | v119.06,93.98 v121.6,93.98 | v23.81,20.64 23.81,25.4 23.18,26.04 v23.18,30.8 | v12.7,46.99 20.64,54.93 v30.16,54.93 | v105.73,84.77 v86.36,65.41
N$13  (via drill 0.35)
  Top 0.152: v119.38,13.02 SV5.6 | v113.98,18.73 113.67,19.05 90.81,19.05 90.49,19.37 67.63,19.37 65.41,17.14 49.53,17.14 47.62,19.05 U2.15 | v117.79,59.69 122.87,54.61 147.96,54.61 152.08,50.48 152.08,44.45 v135.57,44.45
  Bottom 0.152: v113.98,18.73 113.98,18.41 v119.38,13.02 120.02,13.02 122.56,15.56 122.56,31.43 v135.57,44.45 | v117.79,59.69 114.3,63.18 114.3,95.25 DIS1.12
N$14  (via drill 0.35)
  Top 0.152: SV5.7 124.46,1.27 140.97,1.27 158.12,18.41 158.12,92.39 v123.19,92.39 | U2.16 52.39,21.91 v54.93,21.91 | v54.93,24.45 55.24,24.13 v70.17,24.13 | v76.52,17.78 78.74,15.56 v92.71,15.56
  Bottom 0.152: v123.19,92.39 119.7,92.39 116.84,95.25 DIS1.13 | v54.93,24.45 v54.93,21.91 | v76.52,17.78 v70.17,24.13 | v92.71,15.56 105.41,2.86 105.41,2.54 106.05,1.91 120.02,1.91 SV5.7
N$15  (via drill 0.35)
  Top 0.152: DIS1.14 119.38,95.25 152.08,62.55 153.99,62.55 153.99,14.92 140.97,1.91 126.36,1.91 SV5.8 126.05,3.81 v126.05,12.7 | U2.17 53.34,17.78 62.55,17.78 v64.77,20 | v65.72,33.66 67.94,35.88 90.81,35.88 91.44,36.51 101.6,36.51 104.14,33.97 110.81,33.97 111.12,33.66 118.11,33.66 119.06,34.61 120.02,34.61 120.65,33.97 v126.05,33.97
  Bottom 0.152: v64.77,20 64.77,25.72 65.72,26.67 v65.72,33.66 | v126.05,12.7 v126.05,33.97
N$16  (via drill 0.35)
  Top 0.152: v35.24,15.56 56.52,15.56 57.78,14.29 90.49,14.29 v90.81,14.61 94.3,14.61 v96.52,16.83 | v99.06,62.55 99.06,95.25 DIS1.6 | v104.14,31.75 103.82,31.43 103.5,31.43 102.87,30.8 102.87,28.89 v110.17,28.89
  Bottom 0.152: v90.81,14.61 SV4.8 | U2.9 v35.24,15.56 | v99.06,62.55 99.06,56.83 109.54,46.35 109.54,37.15 v104.14,31.75 | v110.17,28.89 110.17,27.62 103.82,21.27 100.97,21.27 v96.52,16.83
N$17  (via drill 0.35)
  Top 0.152: SV4.7 99.06,13.02 58.42,13.02 57.47,12.06 v53.66,12.06 | v47.94,17.78 41.59,17.78 40.64,18.73 40.64,20.32 30.48,20.32 U2.8 | v74.61,73.66 74.61,66.67 25.72,66.67 20.32,61.28 20.32,53.98 v17.46,53.98 | v6.99,32.7 15.56,24.13 27.62,24.13 v29.21,22.54
  Bottom 0.152: v47.94,17.78 v53.66,12.06 | v74.61,73.66 96.2,95.25 DIS1.5 | v17.46,53.98 6.99,43.5 v6.99,32.7 | U2.8 v29.21,22.54
N$18  (via drill 0.35)
  Top 0.152: SV4.6 96.52,5.71 93.34,8.89 93.34,12.38 71.75,12.38 v71.44,12.06 | v67.31,16.19 35.56,16.19 34.61,17.14 28.57,17.14 U2.7 | v64.14,65.72 63.82,65.41 29.53,65.41 25.4,61.28 25.4,40.64 11.75,40.64 7.62,36.51 7.62,34.29 9.84,34.29 11.75,32.38 24.77,32.38 v26.35,30.8
  Bottom 0.152: v67.31,16.19 v71.44,12.06 | v64.14,65.72 93.66,95.25 DIS1.4 | v26.35,30.8 26.35,19.37 U2.7
N$19  (via drill 0.35)
  Top 0.152: v85.09,9.53 73.03,9.53 72.71,9.21 42.86,9.21 38.73,13.34 19.68,13.34 U2.2
  Bottom 0.152: SV4.1 83.82,8.26 v85.09,9.53
N$20  (via drill 0.35)
  Top 0.152: v86.36,9.53 85.41,10.48 73.34,10.48 72.71,9.84 47.62,9.84 43.5,13.97 32.7,13.97 31.11,15.56 20.32,15.56 16.83,19.05 U2.3
  Bottom 0.152: v86.36,9.53 SV4.2
N$21
  Top 0.152: SV4.3 90.81,1.91 92.08,1.91 92.71,2.54 92.71,11.75 72.07,11.75 70.8,10.48 47.62,10.48 43.5,14.61 32.7,14.61 31.11,16.19 21.91,16.19 U2.4
N$22  (via drill 0.35)
  Top 0.152: SV4.4 86.68,8.57 v82.23,8.57 | v81.6,22.23 80.96,21.59 61.91,21.59 60.64,22.86 41.91,22.86 40.64,21.59 23.81,21.59 21.59,19.37 U2.5
  Bottom 0.152: v82.23,8.57 82.23,21.59 v81.6,22.23
N$23  (via drill 0.35)
  Top 0.152: v87.63,10.16 87.31,10.48 86.04,10.48 85.41,11.11 73.03,11.11 v72.71,10.79 | v68.26,22.54 67.31,23.5 47.94,23.5 44.77,26.67 42.23,26.67 40.96,27.94 26.67,27.94 v24.45,25.72
  Bottom 0.152: v87.63,10.16 SV4.5 | v72.71,10.79 72.71,18.1 v68.26,22.54 | v24.45,25.72 24.45,20.95 24.77,20.64 24.77,19.68 U2.6
N$24  (via drill 0.35)
  Top 0.152: v129.54,13.65 SV6.1 | v133.99,41.59 133.67,41.91 120.33,41.91 120.02,42.23 90.17,42.23 88.9,40.96 v71.12,40.96 | v66.04,35.88 65.72,36.2 48.9,36.2 48.26,36.83 20,36.83 17.78,34.61 17.78,33.02 12.7,33.02 U2.40
  Bottom 0.152: v129.54,13.65 129.54,37.15 v133.99,41.59 | v66.04,35.88 v71.12,40.96
N$25  (via drill 0.35)
  Top 0.152: v148.27,10.16 153.35,15.24 153.35,61.59 92.39,61.59 v88.9,58.1 | v84.45,53.66 82.55,51.75 32.07,51.75 27.94,47.62 27.94,40.01 11.75,40.01 8.26,36.51 8.26,35.56 12.7,35.56 U2.39
  Bottom 0.152: SV6.2 138.43,10.16 v148.27,10.16 | v84.45,53.66 v88.9,58.1
N$26  (via drill 0.35)
  Top 0.152: SV6.3 134.62,13.65 v133.99,13.65 | v133.99,39.05 133.35,39.69 v90.17,39.69 | v83.19,34.92 82.87,35.24 73.03,35.24 70.48,32.7 v57.78,32.7 | v57.78,26.67 56.83,25.72 v54.61,25.72 | v55.88,21.27 55.88,19.05 U2.18
  Bottom 0.152: v133.99,39.05 v133.99,13.65 | v90.17,39.69 88.27,37.78 86.04,37.78 v83.19,34.92 | v57.78,26.67 v57.78,32.7 | v54.61,25.72 55.88,24.45 v55.88,21.27
N$27
  Top 0.152: SV6.4 137.16,5.08 146.37,14.29 151.76,14.29 152.08,14.61 152.08,21.27 120.65,21.27 120.02,21.91 118.11,21.91 117.47,21.27 81.28,21.27 80.96,20.95 59.05,20.95 U2.19
PHI2  (via drill 0.35)
  Top 0.152: IC3.4 45.09,39.37 v44.13,38.42 | U2.25 48.26,35.56 43.5,35.56 v43.18,35.24 43.18,33.97 39.05,29.84 23.18,29.84 22.86,30.16 10.48,30.16 6.99,33.66 6.03,33.66 | SV7.4 12.7,14.92 6.35,21.27 6.35,32.38 6.03,32.7 6.03,33.66 | U1.37 19.05,54.93 v18.1,54.93 | 6.03,33.66 v6.03,43.5
  Top 0.305: IC4.3 27.94,92.71 LED1.A
  Bottom 0.152: v44.13,38.42 44.13,36.2 v43.18,35.24 | v18.1,54.93 17.46,54.93 v6.03,43.5
  Bottom 0.813: LED1.A 34.29,97.79 33.5,98.58 4.6,98.58 1.42,95.4 1.42,68.58 5.23,64.77 19.05,64.77 U1.37
RESB  (via drill 0.35)
  Top 0.152: v15.56,55.88 11.43,60.01 U1.40
  Top 0.305: U1.40 11.43,66.04 12.7,67.31 50.8,67.31 54.61,71.12 R1.2 65.04,71.12 SW1.1
  Bottom 0.152: U2.34 36.83,44.45 37.15,44.45 38.1,45.4 38.1,47.94 30.16,55.88 v15.56,55.88
RWB  (via drill 0.35)
  Top 0.152: v16.83,27.62 18.41,29.21 v53.02,29.21 | v143.51,53.34 142.88,53.98 111.44,53.98 107.63,57.78 v90.17,57.78 | v83.82,64.14 81.6,61.91 69.22,61.91 67.94,63.18 28.89,63.18 U1.34 | v73.98,37.78 v59.69,37.78
  Bottom 0.152: SV7.3 10.16,13.65 15.24,18.73 15.24,25.08 16.83,26.67 v16.83,27.62 | v53.02,29.21 53.02,30.16 U2.22 57.15,35.24 v59.69,37.78 | v143.51,53.34 IC2.27 | v83.82,64.14 85.72,62.23 | 85.72,62.23 v90.17,57.78 | v73.98,37.78 73.98,54.93 81.28,62.23 85.72,62.23

### Text on the board
tPlace: Contrast | Clock Generator | Reset
tNames: 10K Pot | 555 | + | 1M Pot | 1uf | 1K | 1K | .01uf | .01uf | 390 | 1K | .01uf | WDC65C02 / CPU | .01uf | 62256 / SRAM | 74LS00 | AT286C256 / EEPROM | .01uf | WDC65C22 / VIA-0 | +5V | GND | RWB | PHI2 | A0 | A1 | A2 | A3 | A4 | A5 | A6 | A7 | A8 | A9 | A10 | A11 | A12 | A13 | A14 | A15 | D0 | D1 | D2 | D3 | D4 | D5 | D6 | D7 | PA0 | PA1 | PA2 | PA3 | PA4 | PA5 | PA6 | PA7 | PB0 | PB1 | PB2 | PB3 | PB4 | PB5 | PB6 | PB7 | CA1 | CA2 | CB1 | CB2 | Breadboard Bus / Connection
bNames: Project NEON Sunrise / 6502 Mainboard / v0.2 - 8/30/2021 / Thomas Mottl / / www.realcheftom.com